# Altium schematic sheet MainboardConn.SchDoc
size 431 x 279 mm; Organization: ORGANIZATION; Address1: ADDRESS 1; Address2: ADDRESS 2; Address3: ADDRESS 3; Address4: ADDRESS 4; Revision: -; SheetNumber: 5; SheetTotal: 5; ENG_APP_DATE: --/--/--; DSN_APP_DATE: --/--/--; CHK_APP_DATE: --/--/--
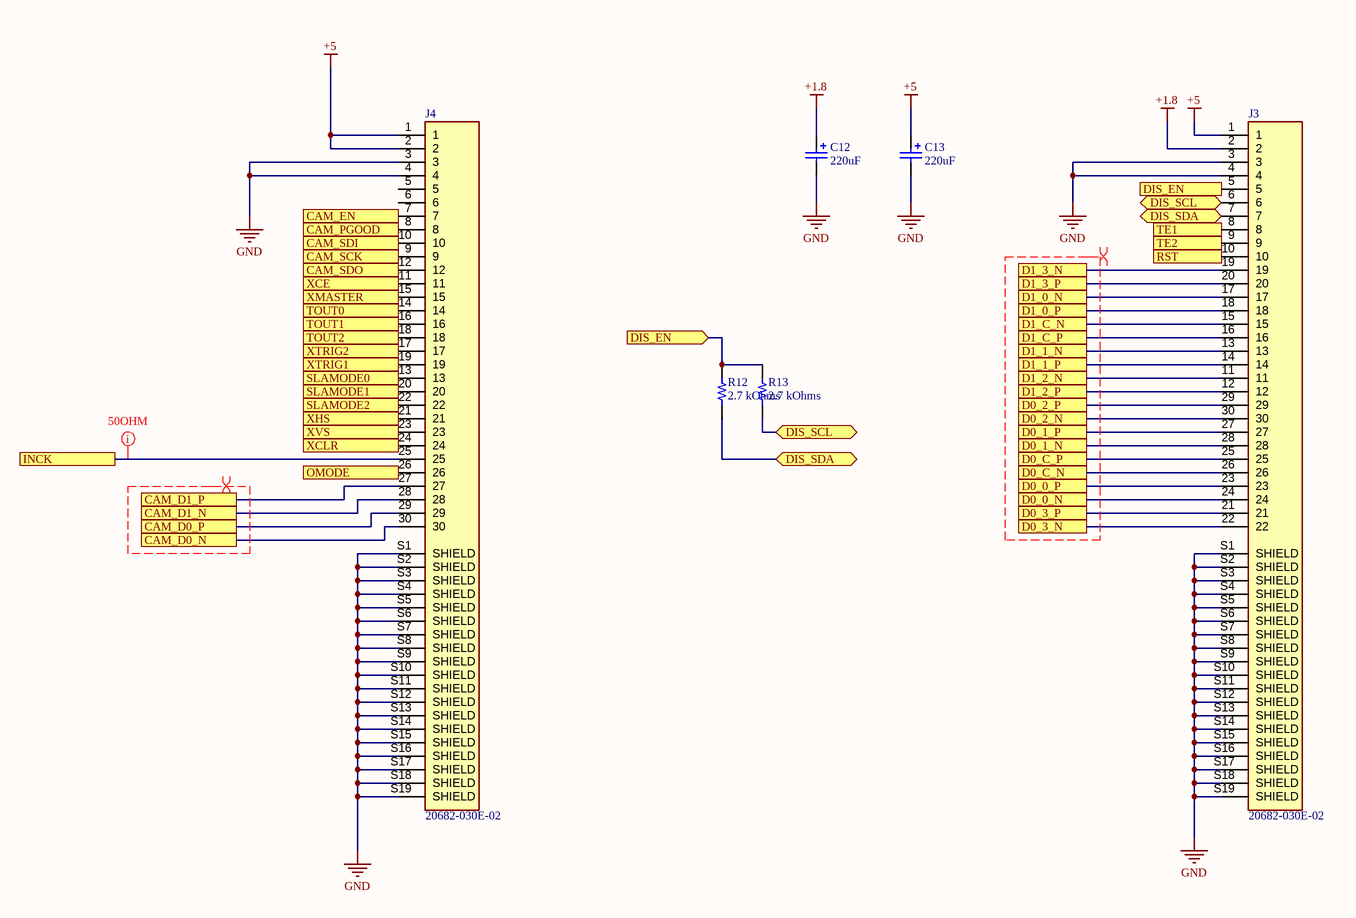
[diagram p0: MainboardConn.SchDoc]

## Parts
C12  220uF  [WCAP-PHGP_L7.3W4.3H1.9]
C13  220uF  [WCAP-PHGP_L7.3W4.3H1.9]
J3  20682-030E-02  [IPEX_20682-030E-02]
J4  20682-030E-02  [IPEX_20682-030E-02]
R12  2.7 kOhms  [RES 0201_0603]
R13  2.7 kOhms  [RES 0201_0603]

## Ports
CAM_D0_N, CAM_D0_P, CAM_D1_N, CAM_D1_P, CAM_EN, CAM_PGOOD, CAM_SCK, CAM_SDI, CAM_SDO, D0_0_N, D0_0_P, D0_1_N, D0_1_P, D0_2_N, D0_2_P, D0_3_N, D0_3_P, D0_C_N, D0_C_P, D1_0_N, D1_0_P, D1_1_N, D1_1_P, D1_2_N, D1_2_P, D1_3_N, D1_3_P, D1_C_N, D1_C_P, DIS_EN (in), DIS_SCL (bidir), DIS_SDA (bidir), INCK, OMODE, RST, SLAMODE0, SLAMODE1, SLAMODE2, TE1, TE2, TOUT0, TOUT1, TOUT2, XCE, XCLR, XHS, XMASTER, XTRIG1, XTRIG2, XVS

## Nets
+1.8: C12.1(P) J3.2
+5: C13.1(P) J3.1 J4.1 J4.2
GND: C12.2(N) C13.2(N) J3.3 J3.4 J3.S1(SHIELD) J3.S2(SHIELD) J3.S3(SHIELD) J3.S4(SHIELD) J3.S5(SHIELD) J3.S6(SHIELD) J3.S7(SHIELD) J3.S8(SHIELD) J3.S9(SHIELD) J3.S10(SHIELD) J3.S11(SHIELD) J3.S12(SHIELD) J3.S13(SHIELD) J3.S14(SHIELD) J3.S15(SHIELD) J3.S16(SHIELD) J3.S17(SHIELD) J3.S18(SHIELD) J3.S19(SHIELD) J4.3 J4.4 J4.S1(SHIELD) J4.S2(SHIELD) J4.S3(SHIELD) J4.S4(SHIELD) J4.S5(SHIELD) J4.S6(SHIELD) J4.S7(SHIELD) J4.S8(SHIELD) J4.S9(SHIELD) J4.S10(SHIELD) J4.S11(SHIELD) J4.S12(SHIELD) J4.S13(SHIELD) J4.S14(SHIELD) J4.S15(SHIELD) J4.S16(SHIELD) J4.S17(SHIELD) J4.S18(SHIELD) J4.S19(SHIELD)
CAM_D0_N: J4.30 ; port CAM_D0_N
CAM_D0_P: J4.29 ; port CAM_D0_P
CAM_D1_N: J4.28 ; port CAM_D1_N
CAM_D1_P: J4.27 ; port CAM_D1_P
CAM_EN: J4.7 ; port CAM_EN
CAM_PGOOD: J4.8 ; port CAM_PGOOD
CAM_SCK: J4.9 ; port CAM_SCK
CAM_SDI: J4.10 ; port CAM_SDI
CAM_SDO: J4.12 ; port CAM_SDO
D0_0_N: J3.24 ; port D0_0_N
D0_0_P: J3.23 ; port D0_0_P
D0_1_N: J3.28 ; port D0_1_N
D0_1_P: J3.27 ; port D0_1_P
D0_2_N: J3.30 ; port D0_2_N
D0_2_P: J3.29 ; port D0_2_P
D0_3_N: J3.22 ; port D0_3_N
D0_3_P: J3.21 ; port D0_3_P
D0_C_N: J3.26 ; port D0_C_N
D0_C_P: J3.25 ; port D0_C_P
D1_0_N: J3.17 ; port D1_0_N
D1_0_P: J3.18 ; port D1_0_P
D1_1_N: J3.13 ; port D1_1_N
D1_1_P: J3.14 ; port D1_1_P
D1_2_N: J3.11 ; port D1_2_N
D1_2_P: J3.12 ; port D1_2_P
D1_3_N: J3.19 ; port D1_3_N
D1_3_P: J3.20 ; port D1_3_P
D1_C_N: J3.15 ; port D1_C_N
D1_C_P: J3.16 ; port D1_C_P
DIS_EN: J3.5 R12.2 R13.2 ; port DIS_EN
DIS_SCL: J3.6 R13.1 ; port DIS_SCL
DIS_SDA: J3.7 R12.1 ; port DIS_SDA
INCK: J4.25 ; port INCK
OMODE: J4.26 ; port OMODE
RST: J3.10 ; port RST
SLAMODE0: J4.13 ; port SLAMODE0
SLAMODE1: J4.20 ; port SLAMODE1
SLAMODE2: J4.22 ; port SLAMODE2
TE1: J3.8 ; port TE1
TE2: J3.9 ; port TE2
TOUT0: J4.14 ; port TOUT0
TOUT1: J4.16 ; port TOUT1
TOUT2: J4.18 ; port TOUT2
XCE: J4.11 ; port XCE
XCLR: J4.24 ; port XCLR
XHS: J4.21 ; port XHS
XMASTER: J4.15 ; port XMASTER
XTRIG1: J4.19 ; port XTRIG1
XTRIG2: J4.17 ; port XTRIG2
XVS: J4.23 ; port XVS

Not connected (* = marked no-connect by the designer): J4 5 6

## Layout directives
differential pair; net class MIPI; differential pair class MIPI: (no net found under the mark)
differential pair; net class SLVS-EC; differential pair class SLVS-EC: (no net found under the mark)
net class 50OHM: INCK

## Notes on the sheet
- DWG. NO.
- REV.
- SHT.
- REVISION
- DESCRIPTION
- DATE
- APPROVED
- ENG:
- APPROVALS
- PROJECT
- DSN:
- CHK:
- REFERENCE DOCUMENTS
- PROJECT REVISION:
- TITLE
- SimulaVR
- DOCUMENT REVISION:
- DESIGN ITEM:
- BOM:
- FAB DWG:
- PCB DWG:
- ASSY DWG:
- SCALE:
- SIZE
- B
- CAGE CODE
- FILE NAME
- DWG NO.
- SHEET
- OF
- REV

## Library data of the parts
C12 C13 = 875015119006: WCAP-PHGP Aluminum Polymer Capacitor, H-Chip SMT, L7.3W4.3H1.9mm, 220uF, 6.3V; Manufacturer: Wurth Elektronik; Capacitance Tolerance: +/-20%; Dissipation Factor: 6%; Endurance: 2000h; ESR: 15mOhm; Leakage Current: 138.6uA; Ripple Current: 5100mA; Technical Reference: PSE2917221M6R3DHCT2HT19; ComponentLink1Description: Manufacturer Link; ComponentLink1URL: https://www.we-online.com/redexpert/article/875015119006?ad; ComponentLink2Description: Datasheet; ComponentLink2URL: https://www.we-online.com/redexpert/spec/875015119006?ad; Category: Aluminum Polymer Capacitors; Match Code: WCAP-PHGP; Manufacturer Part Number: 875015119006; Mount: Surface Mount; Operating Temperature Max: 105°C; Operating Temperature Min: -55°C; Packaging: Tape and Reel; Length: 7.3mm; Width: 4.3mm; Height: 1.9mm; Capacitance: 220uF; Rated Voltage (DC): 6.3V
J3 = 20682-030E-02: Cabline-CAII Rece. Ass'y; MF: {'manufacturer': u'I-PEX'}; Value: *; Availability: Unavailable; Price: None; Package: None; MP: 20682-030E-02
J4 = CMP-004-000000-1: Cabline-CAII Rece. Ass'y; MF: {'manufacturer': u'I-PEX'}; Availability: Unavailable; Price: None; MP: 20682-030E-02; Design Item ID: 20682-030E-02; Source: 20682-030E-02.SchLib; Package: None; Value: *
R12 R13 = ERJ-U01J272C: RES 2.7K OHM 5% 1/20W 0201 SMD; Manufacturer: Panasonic Electronic Components; Power (Watts): 0.05W, 1/20W; Temperature Coefficient: ±200ppm/°C; Part Number: ERJ-U01J272C; Value: 2.7 kOhms; ComponentLink1Description: Datasheet; ComponentLink1URL: https://industrial.panasonic.com/cdbs/www-data/pdf/RDP0000/AOA0000C334.pdf; ComponentLink2Description: DigiKey Link; ComponentLink2URL: https://www.digikey.com/en/products/detail/panasonic-electronic-components/ERJ-U01J272C/11641374; Composition: Thick Film; Device Package: 0201 (0603 Metric); Features: Anti-Sulfur; Height - Seated (Max): 0.010" (0.26mm); LastUpdated: 2022-04-12 22:15:26; Lifecycle Status: Active; Minimum Order: 1; Number of Terminations: 2; Operating Temperature: -55°C ~ 125°C; Package / Case: 0201 (0603 Metric); Packaging: TapeAndReel; PartId: 64645; Part Status: Active; Price: 0.04; Resistance: 2.7 kOhms; Series: ERJ-U01; Size / Dimension: 0.024" L x 0.012" W (0.60mm x 0.30mm); Supplier 1: DigiKey; Supplier Part Number 1: 10-ERJ-U01J272CCT-ND; Supplier Device Package: 0201; Tolerance: ±5%